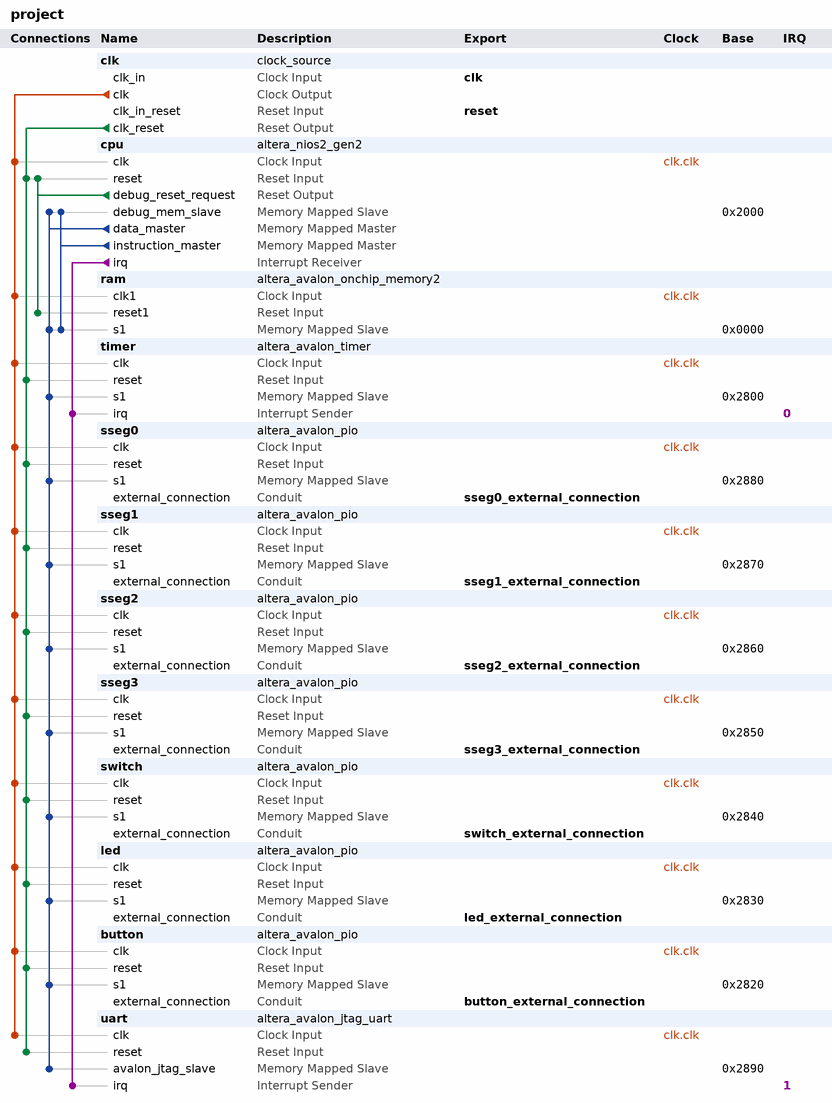
[diagram p0: system contents]
# Platform Designer (Qsys) system project, Cyclone V 5CSEMA5F31C6
# Parameters at their usual value, and those the tool derives, are not listed.
package require -exact qsys 17.0
create_system project
set_project_property DEVICE_FAMILY {Cyclone V}
set_project_property DEVICE 5CSEMA5F31C6

add_instance clk clock_source 17.0
set_instance_parameter_value clk clockFrequency 50000000

add_instance cpu altera_nios2_gen2 17.0
set_instance_parameter_value cpu dcache_size 2048
set_instance_parameter_value cpu exceptionSlave ram.s1
set_instance_parameter_value cpu icache_size 4096
set_instance_parameter_value cpu impl Tiny
set_instance_parameter_value cpu resetSlave ram.s1

add_instance ram altera_avalon_onchip_memory2 17.0
set_instance_parameter_value ram dataWidth 32
set_instance_parameter_value ram dualPort false
set_instance_parameter_value ram initMemContent true
set_instance_parameter_value ram initializationFileName onchip_mem.hex
set_instance_parameter_value ram memorySize 6144

add_instance timer altera_avalon_timer 17.0
set_instance_parameter_value timer period 100
set_instance_parameter_value timer periodUnits MSEC

add_instance sseg0 altera_avalon_pio 17.0
set_instance_parameter_value sseg0 direction Output
set_instance_parameter_value sseg0 width 8

add_instance sseg1 altera_avalon_pio 17.0
set_instance_parameter_value sseg1 direction Output
set_instance_parameter_value sseg1 width 8

add_instance sseg2 altera_avalon_pio 17.0
set_instance_parameter_value sseg2 direction Output
set_instance_parameter_value sseg2 width 8

add_instance sseg3 altera_avalon_pio 17.0
set_instance_parameter_value sseg3 direction Output
set_instance_parameter_value sseg3 width 8

add_instance switch altera_avalon_pio 17.0
set_instance_parameter_value switch direction Input
set_instance_parameter_value switch width 3

add_instance led altera_avalon_pio 17.0
set_instance_parameter_value led direction Output
set_instance_parameter_value led width 8

add_instance button altera_avalon_pio 17.0
set_instance_parameter_value button direction Input
set_instance_parameter_value button width 3

add_instance uart altera_avalon_jtag_uart 17.0
set_instance_parameter_value uart simInteractiveOptions NO_INTERACTIVE_WINDOWS

# connections
add_connection clk.clk button.clk clock
add_connection clk.clk cpu.clk clock
add_connection clk.clk led.clk clock
add_connection clk.clk ram.clk1 clock
add_connection clk.clk sseg0.clk clock
add_connection clk.clk sseg1.clk clock
add_connection clk.clk sseg2.clk clock
add_connection clk.clk sseg3.clk clock
add_connection clk.clk switch.clk clock
add_connection clk.clk timer.clk clock
add_connection clk.clk uart.clk clock
add_connection clk.clk_reset button.reset reset
add_connection clk.clk_reset cpu.reset reset
add_connection clk.clk_reset led.reset reset
add_connection clk.clk_reset sseg0.reset reset
add_connection clk.clk_reset sseg1.reset reset
add_connection clk.clk_reset sseg2.reset reset
add_connection clk.clk_reset sseg3.reset reset
add_connection clk.clk_reset switch.reset reset
add_connection clk.clk_reset timer.reset reset
add_connection clk.clk_reset uart.reset reset
add_connection cpu.debug_reset_request cpu.reset reset
add_connection cpu.debug_reset_request ram.reset1 reset
add_connection cpu.data_master button.s1 avalon
set_connection_parameter_value cpu.data_master/button.s1 baseAddress 0x2820
add_connection cpu.data_master cpu.debug_mem_slave avalon
set_connection_parameter_value cpu.data_master/cpu.debug_mem_slave baseAddress 0x2000
add_connection cpu.data_master led.s1 avalon
set_connection_parameter_value cpu.data_master/led.s1 baseAddress 0x2830
add_connection cpu.data_master ram.s1 avalon
set_connection_parameter_value cpu.data_master/ram.s1 baseAddress 0x0000
add_connection cpu.data_master sseg0.s1 avalon
set_connection_parameter_value cpu.data_master/sseg0.s1 baseAddress 0x2880
add_connection cpu.data_master sseg1.s1 avalon
set_connection_parameter_value cpu.data_master/sseg1.s1 baseAddress 0x2870
add_connection cpu.data_master sseg2.s1 avalon
set_connection_parameter_value cpu.data_master/sseg2.s1 baseAddress 0x2860
add_connection cpu.data_master sseg3.s1 avalon
set_connection_parameter_value cpu.data_master/sseg3.s1 baseAddress 0x2850
add_connection cpu.data_master switch.s1 avalon
set_connection_parameter_value cpu.data_master/switch.s1 baseAddress 0x2840
add_connection cpu.data_master timer.s1 avalon
set_connection_parameter_value cpu.data_master/timer.s1 baseAddress 0x2800
add_connection cpu.data_master uart.avalon_jtag_slave avalon
set_connection_parameter_value cpu.data_master/uart.avalon_jtag_slave baseAddress 0x2890
add_connection cpu.instruction_master cpu.debug_mem_slave avalon
set_connection_parameter_value cpu.instruction_master/cpu.debug_mem_slave baseAddress 0x2000
add_connection cpu.instruction_master ram.s1 avalon
set_connection_parameter_value cpu.instruction_master/ram.s1 baseAddress 0x0000
add_connection cpu.irq timer.irq interrupt
set_connection_parameter_value cpu.irq/timer.irq irqNumber 0
add_connection cpu.irq uart.irq interrupt
set_connection_parameter_value cpu.irq/uart.irq irqNumber 1

# exported interfaces
add_interface button_external_connection conduit end
set_interface_property button_external_connection EXPORT_OF button.external_connection
add_interface clk clock sink
set_interface_property clk EXPORT_OF clk.clk_in
add_interface led_external_connection conduit end
set_interface_property led_external_connection EXPORT_OF led.external_connection
add_interface reset reset sink
set_interface_property reset EXPORT_OF clk.clk_in_reset
add_interface sseg0_external_connection conduit end
set_interface_property sseg0_external_connection EXPORT_OF sseg0.external_connection
add_interface sseg1_external_connection conduit end
set_interface_property sseg1_external_connection EXPORT_OF sseg1.external_connection
add_interface sseg2_external_connection conduit end
set_interface_property sseg2_external_connection EXPORT_OF sseg2.external_connection
add_interface sseg3_external_connection conduit end
set_interface_property sseg3_external_connection EXPORT_OF sseg3.external_connection
add_interface switch_external_connection conduit end
set_interface_property switch_external_connection EXPORT_OF switch.external_connection

set_interconnect_requirement {$system} qsys_mm.clockCrossingAdapter HANDSHAKE
set_interconnect_requirement {$system} qsys_mm.enableEccProtection FALSE
set_interconnect_requirement {$system} qsys_mm.insertDefaultSlave FALSE
set_interconnect_requirement {$system} qsys_mm.maxAdditionalLatency 1

save_system project.qsys
